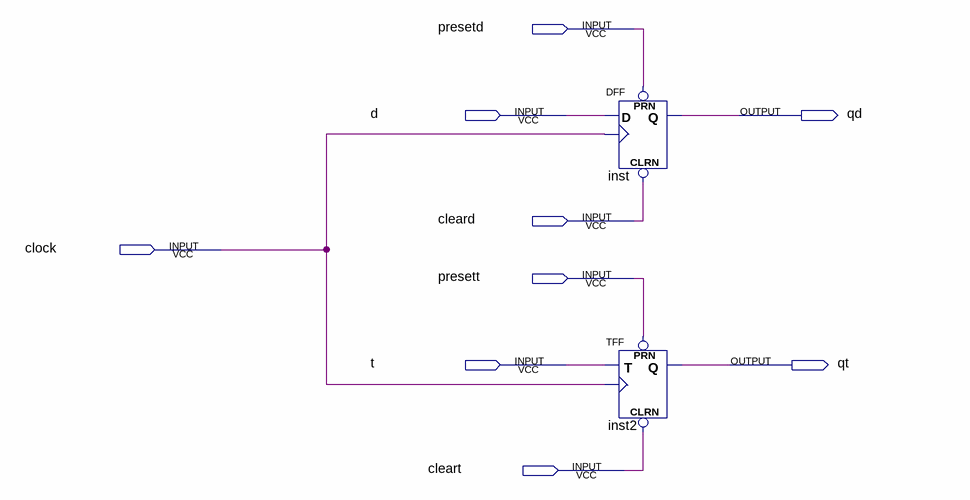
[diagram p0: schematic sheet]
// Quartus schematic dff.bdf as structural Verilog: 2 symbols, 9 pins
module dff (
  input  presetd,
  input  d,
  input  cleard,
  input  clock,
  input  presett,
  input  t,
  input  cleart,
  output qd,
  output qt
);

  DFF inst (.CLRN(cleard), .CLK(clock), .D(d), .PRN(presetd), .Q(qd));
  TFF inst2 (.PRN(presett), .CLRN(cleart), .T(t), .CLK(clock), .Q(qt));
endmodule
